# EasyEDA Pro project ProPrj_AD835乘法器_2025-07-16.epro

# Schematic Schematic1
Board Name: Board1; Create Date: 2025-07-16; Page Name: P1; Project Name: AD835乘法器; Schematic Name: Schematic1; Update Date: 2025-07-16; Company: 嘉立创EDA; Page Size: A4; Version: V1.0
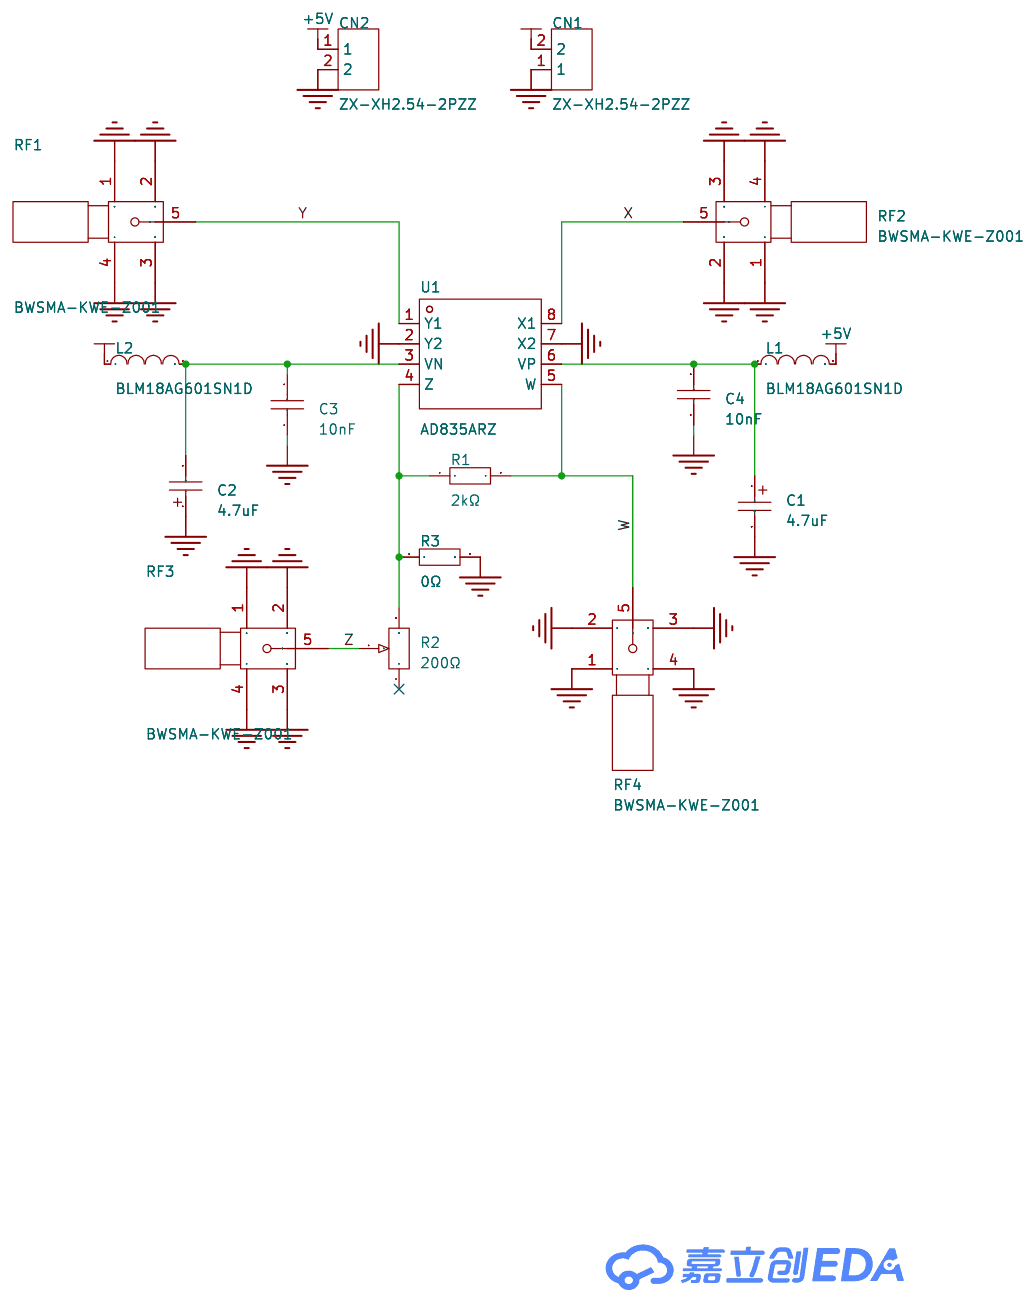
[diagram p0: schematic sheet]

## Parts
C1  4.7uF  [CASE-A_3216]
C2  4.7uF  [CASE-A_3216]
C3  10nF  [C0603]
C4  10nF  [C0603]
CN1  ZX-XH2.54-2PZZ  [CONN-TH_2P-P2.50_HX25003-2A]
CN2  ZX-XH2.54-2PZZ  [CONN-TH_2P-P2.50_HX25003-2A]
L1  BLM18AG601SN1D  [L0603]
L2  BLM18AG601SN1D  [L0603]
R1  2kΩ  [R0603]
R2  200Ω  [RES-ADJ-TH_3P-L9.5-W4.9-P2.50-L_3296W]
R3  0Ω  [R0603]
RF1  BWSMA-KWE-Z001  [SMA-TH_BWSMA-KWE-Z001]
RF2  BWSMA-KWE-Z001  [SMA-TH_BWSMA-KWE-Z001]
RF3  BWSMA-KWE-Z001  [SMA-TH_BWSMA-KWE-Z001]
RF4  BWSMA-KWE-Z001  [SMA-TH_BWSMA-KWE-Z001]
U1  AD835ARZ  [SOIC-8_L4.9-W3.9-P1.27-LS6.0-TL]

## Library data of the parts
C1 C2 = TAJA475K016RNJ: 容值:4.7uF;精度:±10%;额定电压:16V;等效串联电阻:4Ω@100kHz;; LCSC Part Name: 4.7uF ±10% 16V; Supplier Part: C7187; Manufacturer: Kyocera AVX; Supplier Footprint: CASE-A-3216; JLCPCB Part Class: 扩展库; Datasheet: https://atta.szlcsc.com/upload/public/pdf/source/20160107/1457707750344.pdf; Supplier: LCSC; Tolerance: ±10%; Rated Voltage: 16V; Equivalent Series Resistance(ESR): 4Ω@100kHz; Operating Temperature: -55℃~+125℃
C3 C4 = 0603B103K500NT: 容值:10nF;精度:±10%;额定电压:50V;温度系数:X7R;; LCSC Part Name: 10nF ±10% 50V; Supplier Part: C57112; Manufacturer: FH(风华); Supplier Footprint: 0603; JLCPCB Part Class: 基础库; Datasheet: https://atta.szlcsc.com/upload/public/pdf/source/20200305/C486355_26A10D38EF8C2A5C37091D0039909270.pdf; Supplier: LCSC; Tolerance: ±10%; Voltage Rating: 50V; Temperature Coefficient: X7R
CN1 CN2 = ZX-XH2.54-2PZZ: 插针结构:1x2P;间距:2.5mm;安装方式:直插;参考系列:XH;总PIN数:2P;排数:1;每排PIN数:2;行距:-;额定电流:3A;触头材质:黄铜;触头镀层:锡;工作温度:-25℃~+85℃;; LCSC Part Name: 1x2P 间距:2.5mm 直插 系列:XH; Supplier Part: C7429632; Manufacturer: Megastar(兆星); Supplier Footprint: 插件,P=2.5mm; JLCPCB Part Class: 扩展库; Datasheet: https://atta.szlcsc.com/upload/public/pdf/source/20230619/19BA6947230AA44A04D3EDD65E618FD0.pdf; Supplier: LCSC; Pins Structure: 1x2P; Pitch: 2.5mm; Mounting Type: 直插; Reference Series: XH; Number of Pins: 2P; Number of Rows: 1; Number of PINs Per Row: 2; Current Rating: 3A; Contact Material: 黄铜; Contact Plating: 锡; Operating Temperature: -25℃~+85℃; Voltage Rating: 250V; Plastic Material: PA66; Flame Retardant Rating: UL94V-0; Color: 白色; Z-Height of the Board: 7mm; X-Length of Bottom Edge on Board (Spacing Line): 7.5mm; Y-Width of Bottom Edge on Board: 5.9mm
L1 L2 = BLM18AG601SN1D: 阻抗@频率:600Ω@100MHz;误差:±25%;直流电阻(DCR):380mΩ;; LCSC Part Name: 单路 0603磁珠 阻抗600Ω@100MHz; Supplier Part: C19330; Manufacturer: muRata(村田); Supplier Footprint: 0603; JLCPCB Part Class: 扩展库; Datasheet: https://atta.szlcsc.com/upload/public/pdf/source/20180329/C160981_FD3C2D2622A377E203B89F4AA32B0741.pdf; Supplier: LCSC; Impedance @ Frequency: 600Ω@100MHz; Tolerance: ±25%; DC Resistance(DCR): 380mΩ; Current Rating: 500mA; Number of Circuits: 1
R1 = 0603WAF2001T5E: 电阻类型:厚膜电阻;阻值:2kΩ;精度:±1%;功率:100mW;最大工作电压:75V;温度系数:±100ppm/℃;; LCSC Part Name: 2kΩ ±1% 100mW 厚膜电阻; Supplier Part: C22975; Manufacturer: UNI-ROYAL(厚声); Supplier Footprint: 0603; JLCPCB Part Class: 基础库; Datasheet: https://atta.szlcsc.com/upload/public/pdf/source/20200306/C422600_1E6D84923E4A46A82E41ADD87F860B5C.pdf; Supplier: LCSC; Type: 厚膜电阻; Tolerance: ±1%; Power(Watts): 100mW; Overload Voltage (Max): 75V; Temperature Coefficient: ±100ppm/℃; Operating Temperature Range: -55℃~+155℃
R2 = 3296W-1-201: 阻值:200Ω;精度:±10%;; LCSC Part Name: 200Ω ±10%; Supplier Part: C118939; Manufacturer: BOCHEN(博晨); Supplier Footprint: 插件; JLCPCB Part Class: 扩展库; Datasheet: https://atta.szlcsc.com/upload/public/pdf/source/20171114/C118939_15106326614771117428.pdf; Supplier: LCSC; Tolerance: ±10%
R3 = 0603WAF0000T5E: 电阻类型:厚膜电阻;阻值:0Ω;精度:±1%;功率:100mW;最大工作电压:75V;; LCSC Part Name: 0Ω ±1% 100mW 厚膜电阻; Supplier Part: C21189; Manufacturer: UNI-ROYAL(厚声); Supplier Footprint: 0603; JLCPCB Part Class: 基础库; Datasheet: https://atta.szlcsc.com/upload/public/pdf/source/20200306/C422600_1E6D84923E4A46A82E41ADD87F860B5C.pdf; Supplier: LCSC; Type: 厚膜电阻; Tolerance: ±1%; Power(Watts): 100mW; Overload Voltage (Max): 75V; Operating Temperature Range: -55℃~+155℃
RF1-RF4 = BWSMA-KWE-Z001: 连接器类型:板端;接口类型:内孔;端口数量:1;接口直径:5.3mm;接口长度/高度:-;频率-最大值:-;射频系列:SMA;阻抗:50Ω;样式:弯头;触头材质:-;触头镀层:-;工作温度范围:-;焊接温度(最大值):-;; LCSC Part Name: 内孔 SMA 弯头; Supplier Part: C496551; Manufacturer: BAT WIRELESS(蝙蝠无线); Supplier Footprint: 插件; JLCPCB Part Class: 扩展库; Datasheet: https://atta.szlcsc.com/upload/public/pdf/source/20231017/997A8C2ADA7F8034A89BE1264F38CE52.pdf; Supplier: LCSC; Connector Type: 板端; Interface Type: 内孔; Number of Ports: 1; Interface Diameter: 5.3mm; RF Series: SMA; Impedance: 50Ω; Style: 弯头
U1 = AD835ARZ: 象限:四象限;压摆率(SR):1000V/us;带宽:250MHz;; LCSC Part Name: 250 MHz 四象限电压输出乘法器; Supplier Part: C26332; Manufacturer: ADI(亚德诺); Supplier Footprint: SOIC-8; JLCPCB Part Class: 扩展库; Datasheet: https://atta.szlcsc.com/upload/public/pdf/source/20140314/1457707016009.pdf; Supplier: LCSC; Quadrant: 四象限; Slew Rate: 1000V/us; Bandwidth: 250MHz; Voltage - Supply: -4.5V~5.5V; Current - Supply: 16mA; Operating Temperature: -40℃~+85℃

## Nets
+5V: CN2.1 L1.2
-5V: CN1.2 L2.1
GND: C1.2 C2.1 C3.1 C4.1 CN1.1 CN2.2 R3.2 RF1.1 RF1.2 RF1.3 RF1.4 RF2.1 RF2.2 RF2.3 RF2.4 RF3.1 RF3.2 RF3.3 RF3.4 RF4.1 RF4.2 RF4.3 RF4.4 U1.2(Y2) U1.7(X2)
W: R1.2 RF4.5 U1.5(W)
X: RF2.5 U1.8(X1)
Y: RF1.5 U1.1(Y1)
Z: R2.2 RF3.5
Net-(C1-1): C1.1 C4.2 L1.1 U1.6(VP)
Net-(C2-2): C2.2 C3.2 L2.2 U1.3(VN)
Net-(R1-1): R1.1 R2.3 R3.1 U1.4(Z)

Not connected (* = marked no-connect by the designer): R2 1*

# Board PCB1
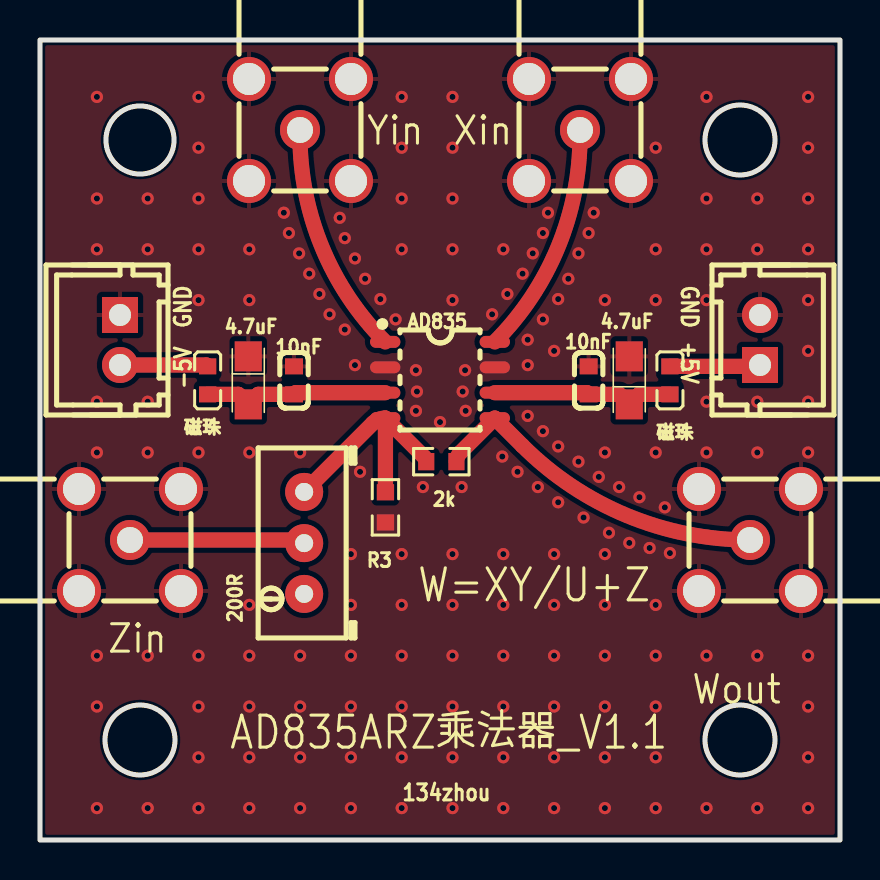
[diagram p1: board, top side]
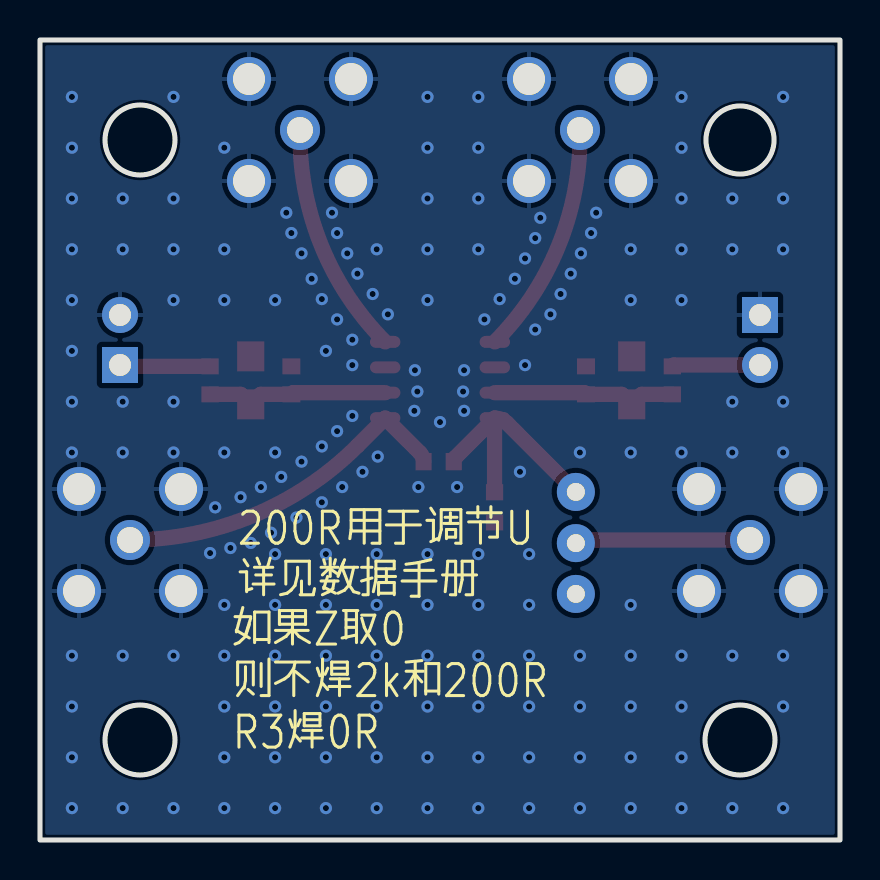
[diagram p2: board, bottom side, seen from below]

Outline 40 x 40 mm; copper layers: Top Layer, Bottom Layer. Coordinates in mm from the lower left corner of the outline.
Outline path: rectangle 0,40 40,0 ; circle c5,35 r1.7 ; circle c5,5 r1.75 ; circle c35,35 r1.75 ; circle c35,5 r1.75
Stack: Top Layer 0.035mm / Dielectric1 1.51mm FR4 er 4.5 / Bottom Layer 0.035mm

## Design rules (mm)
template: JLCPCB Capability(Two Layers Board)
spacing copperThickness1oz (default): track to track 0.102, other pairs 0.152 to 0.3
spacing copperThickness2oz: track to track 0.203, other pairs 0.152 to 0.3
track width copperThickness1oz (default): min 0.127, default 0.254, max 2.54
track width copperThickness2oz: min 0.203, default 0.254, max 2.54
differential pair differentialPair (default): width min 0.127, default 0.254, max 2.54; gap min 0.152, default 0.152
via viaSize (default): diameter min 0.5, default 0.61, max 10; hole min 0.3, default 0.305, max 6.3

## Placement (name value [footprint] x y rotation side)
2k  2kΩ  [R0603]  20.07 18.92 0 top
4.7uF  -  [CASE-A_3216]  29.46 22.98 90 top
4.7uF#2  -  [CASE-A_3216]  10.41 22.98 270 top
10nF  -  [C0603]  12.7 22.98 270 top
10nF#2  -  [C0603]  27.43 22.98 270 top
200R  200Ω  [RES-ADJ-TH_3P-L9.5-W4.9-P2.50-L_3296W]  13.21 14.85 90 top
AD835  AD835ARZ  [SOIC-8_L4.9-W3.9-P1.27-LS6.0-TL]  20 23 0 top
CN1  ZX-XH2.54-2PZZ  [CONN-TH_2P-P2.50_HX25003-2A]  4 25 270 top
CN2  ZX-XH2.54-2PZZ  [CONN-TH_2P-P2.50_HX25003-2A]  36 25 90 top
R3  0Ω  [R0603]  17.27 16.63 270 top
Wout  BWSMA-KWE-Z001  [SMA-TH_BWSMA-KWE-Z001]  35.5 15 0 top
Xin  BWSMA-KWE-Z001  [SMA-TH_BWSMA-KWE-Z001]  27 35.5 90 top
Yin  BWSMA-KWE-Z001  [SMA-TH_BWSMA-KWE-Z001]  13 35.5 90 top
Zin  BWSMA-KWE-Z001  [SMA-TH_BWSMA-KWE-Z001]  4.5 15 180 top
磁珠  -  [L0603]  8.38 22.98 270 top
磁珠#2  -  [L0603]  31.5 22.98 90 top

## Footprints (pads in the part's own frame, mm; a bottom-side part is the same pattern mirrored in y, then rotated)
C0603
  rect 0.8x0.9 smd: 1(-0.7,0) 2(0.7,0)
CASE-A_3216
  rect 1.5x1.359 smd: 1(-1.2,0) 2(1.2,0)
CONN-TH_2P-P2.50_HX25003-2A
  rect 1.8x1.8 hole 1.1: 1(-1.25,0)
  round 1.8 hole 1.1: 2(1.25,0)
L0603
  rect 0.8x0.864 smd: 1(-0.7,0) 2(0.7,0)
R0603
  rect 0.806x0.864 smd: 1(-0.753,0) 2(0.753,0)
RES-ADJ-TH_3P-L9.5-W4.9-P2.50-L_3296W
  round 1.9 hole 0.9: 1(-2.55,0) 2(-0.01,0) 3(2.55,0)
SMA-TH_BWSMA-KWE-Z001
  round 2.2 hole 1.6: 1(-2.55,-2.55) 2(-2.55,2.55) 3(2.55,2.55) 4(2.55,-2.55)
  round 2 hole 1.3: 5(0,0)
SOIC-8_L4.9-W3.9-P1.27-LS6.0-TL
  oval 1.52x0.6 smd: 1(-2.74,1.905) 2(-2.74,0.635) 3(-2.74,-0.635) 4(-2.74,-1.905) 5(2.74,-1.905) 6(2.74,-0.635) 7(2.74,0.635) 8(2.74,1.905)

## Nets
+5V: CN2.1 磁珠#2.2
-5V: CN1.2 磁珠.1
GND: 4.7uF.2 4.7uF#2.1 10nF.1 10nF#2.1 AD835.2 AD835.7 CN1.1 CN2.2 R3.2 Wout.1 Wout.2 Wout.3 Wout.4 Xin.1 Xin.2 Xin.3 Xin.4 Yin.1 Yin.2 Yin.3 Yin.4 Zin.1 Zin.2 Zin.3 Zin.4
W: 2k.2 AD835.5 Wout.5
X: AD835.8 Xin.5
Y: AD835.1 Yin.5
Z: 200R.2 Zin.5
$1N548: 4.7uF.1 10nF#2.2 AD835.6 磁珠#2.1
$1N585: 4.7uF#2.2 10nF.2 AD835.3 磁珠.2
$1N1412: 2k.1 200R.3 AD835.4 R3.1

Pads without a net: 200R 1

## Via types
v1: diameter 0.61, hole 0.305, Top Layer to Bottom Layer, 176 vias

## Routing (per net, layer and track width the routed paths; a pad name or vN(x,y) marks a point on that pad's centre or on a via; arc(x,y) is an arc through that point)
+5V: length 4.5
  Top Layer w0.762: 磁珠#2.2 35.93,23.68 CN2.1
-5V: length 4.4
  Top Layer w0.762: 磁珠.1 8.31,23.75 CN1.2
GND:
  vias: v1(2.84,37.16) v1(2.84,32.08) v1(2.84,29.53) v1(2.84,21.92) v1(2.84,19.38) v1(2.84,9.22) v1(2.84,6.67) v1(2.84,1.59) v1(5.38,32.08) v1(5.38,29.53) v1(5.38,21.92) v1(5.38,19.38) v1(5.38,9.22) v1(5.38,1.59) v1(7.93,37.16) v1(7.93,34.61) v1(7.93,32.08) v1(7.93,29.53) v1(7.93,27) v1(7.93,19.38) v1(7.93,9.22) v1(7.93,6.67) v1(7.93,4.14) v1(7.93,1.59) v1(10.47,29.53) v1(10.47,27) v1(10.47,19.38) v1(10.47,11.75) v1(10.47,9.22) v1(10.47,6.67) v1(10.47,4.14) v1(10.47,1.59) v1(12.19,31.36) v1(12.45,30.35) v1(12.95,29.33) v1(13,19.38) v1(13,9.22) v1(13,6.67) v1(13,4.14) v1(13,1.59) v1(13.46,28.32) v1(13.97,27.3) v1(14.48,26.28) v1(14.99,31.11) v1(15.24,30.09) v1(15.24,25.52) v1(15.54,14.3) v1(15.54,11.75) v1(15.54,9.22) v1(15.54,6.67) v1(15.54,4.14) v1(15.54,1.59) v1(15.75,29.08) v1(15.75,23.74) v1(16,18.41) v1(16.26,28.06) v1(17.02,27.05) v1(17.78,26.03) v1(18.09,37.16) v1(18.09,34.61) v1(18.09,32.08) v1(18.09,29.53) v1(18.09,14.3) v1(18.09,11.75) v1(18.09,9.22) v1(18.09,6.67) v1(18.09,4.14) v1(18.09,1.59) v1(18.8,23.49) v1(18.85,22.42) v1(18.8,21.46) v1(19.15,17.65) v1(20,20.9) v1(20.62,37.16) v1(20.62,34.61) v1(20.62,32.08) v1(20.62,29.53) v1(20.62,27) v1(20.62,14.3) v1(20.62,11.75) v1(20.62,9.22) v1(20.62,6.67) v1(20.62,4.14) v1(20.62,1.59) v1(21.13,22.42) v1(21.08,17.65) v1(21.25,23.49) v1(21.28,21.46) v1(22.61,26.28) v1(23.11,19.17) v1(23.16,29.53) v1(23.16,14.3) v1(23.16,11.75) v1(23.16,9.22) v1(23.16,6.67) v1(23.16,4.14) v1(23.16,1.59) v1(23.37,27.3) v1(23.88,18.41) v1(24.13,28.32) v1(24.38,25.01) v1(24.39,23.74) v1(24.38,21.2) v1(24.64,29.33) v1(24.89,17.65) v1(25.15,30.35) v1(25.15,26.03) v1(25.15,20.44) v1(25.4,31.36) v1(25.71,24.45) v1(25.71,14.3) v1(25.71,11.75) v1(25.71,9.22) v1(25.71,6.67) v1(25.71,4.14) v1(25.71,1.59) v1(25.91,27.05) v1(25.91,19.68) v1(25.91,16.89) v1(26.42,28.06) v1(26.92,29.33) v1(26.92,18.92) v1(27.18,16.12) v1(27.43,30.35) v1(27.69,31.36) v1(27.94,18.16) v1(28.25,27) v1(28.25,19.38) v1(28.25,14.3) v1(28.25,11.75) v1(28.25,9.22) v1(28.25,6.67) v1(28.25,4.14) v1(28.25,1.59) v1(28.45,15.36) v1(28.96,17.65) v1(29.46,14.85) v1(29.97,17.14) v1(30.48,14.6) v1(30.78,34.61) v1(30.78,29.53) v1(30.78,27) v1(30.78,19.38) v1(30.78,11.75) v1(30.78,9.22) v1(30.78,6.67) v1(30.78,4.14) v1(30.78,1.59) v1(31.24,16.63) v1(31.5,14.35) v1(33.32,37.16) v1(33.32,32.08) v1(33.32,29.53) v1(33.32,27) v1(33.32,21.92) v1(33.32,19.38) v1(33.32,9.22) v1(33.32,1.59) v1(35.87,32.08) v1(35.87,29.53) v1(35.87,21.92) v1(35.87,19.38) v1(35.87,9.22) v1(35.87,1.59) v1(38.41,37.16) v1(38.41,34.61) v1(38.41,32.08) v1(38.41,29.53) v1(38.41,27) v1(38.41,24.45) v1(38.41,21.92) v1(38.41,19.38) v1(38.41,9.22) v1(38.41,6.67) v1(38.41,4.14) v1(38.41,1.59)
W: length 17.5
  Top Layer w0.762: 2k.2 arc(20.87,19.15) 21,19.36 AD835.5 24.12,19.71 arc(29.34,16.22) Wout.5
X: length 11.7
  Top Layer w0.762: Xin.5 27,35.19 arc(25.89,29.62) AD835.8
Y: length 11.7
  Top Layer w0.762: Yin.5 13,35.19 arc(14.11,29.62) AD835.1
Z: length 8.7
  Top Layer w0.762: Zin.5 12.83,15 arc(13.04,14.96) 200R.2
$1N548: length 9.2
  Top Layer w0.762: AD835.6 27.35,22.36 10nF#2.2 28.96,22.28 4.7uF.1 29.96,22.28 磁珠#2.1
$1N585: length 9.3
  Top Layer w0.762: AD835.3 12.78,22.36 10nF.2 10.91,22.28 4.7uF#2.2 9.91,22.28 磁珠.2
$1N1412: length 12.3
  Top Layer w0.762: AD835.4 19.22,19.13 arc(19.29,19.03) 2k.1 ; AD835.4 arc(16.93,21.03) 16.64,20.84 200R.3 ; AD835.4 arc(17.27,21.08) 17.27,21.07 R3.1

## Copper pours and planes (outline as drawn; the poured copper is in the pictures)
GND on Top Layer: -2.29,42.29 41.4,42.29 41.4,-1.66 -2.29,-1.66
GND on Bottom Layer: -1.27,44.32 40.64,44.32 40.64,-2.42 -1.27,-2.42

## Text on the board
Bottom Silkscreen Layer: 200R用于调节U / 详见数据手册 | 如果Z取0 / 则不焊2k和200R / R3焊0R
Top Silkscreen Layer: 134zhou | GND | -5V | +5V | W=XY/U+Z | AD835ARZ乘法器_V1.1
